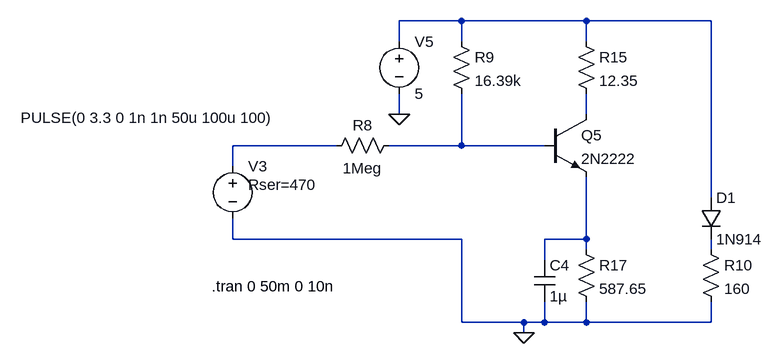
[diagram p0: schematic LED_Driver.asc]
LED_Driver.asc, the LTspice schematic file:
Version 4
SHEET 1 2416 1012
WIRE 1504 448 1408 448
WIRE 1696 448 1504 448
WIRE 1888 448 1696 448
WIRE 1408 480 1408 448
WIRE 1504 480 1504 448
WIRE 1696 480 1696 448
WIRE 1408 592 1408 560
WIRE 1696 592 1696 560
WIRE 1312 640 1152 640
WIRE 1504 640 1504 560
WIRE 1504 640 1392 640
WIRE 1632 640 1504 640
WIRE 1152 672 1152 640
WIRE 1888 720 1888 448
WIRE 1152 784 1152 752
WIRE 1504 784 1152 784
WIRE 1696 784 1696 688
WIRE 1696 784 1632 784
WIRE 1696 800 1696 784
WIRE 1888 800 1888 784
WIRE 1632 816 1632 784
WIRE 1504 912 1504 784
WIRE 1600 912 1504 912
WIRE 1632 912 1632 880
WIRE 1632 912 1600 912
WIRE 1696 912 1696 880
WIRE 1696 912 1632 912
WIRE 1888 912 1888 880
WIRE 1888 912 1696 912
WIRE 1600 928 1600 912
FLAG 1408 592 0
FLAG 1600 928 0
SYMBOL voltage 1152 656 R0
WINDOW 123 0 0 Left 2
WINDOW 39 24 44 Left 2
WINDOW 3 -326 -59 Left 2
SYMATTR SpiceLine Rser=470
SYMATTR Value PULSE(0 3.3 0 1n 1n 50u 100u 100)
SYMATTR InstName V3
SYMBOL res 1408 624 R90
WINDOW 0 0 56 VBottom 2
WINDOW 3 35 56 VTop 2
SYMATTR InstName R8
SYMATTR Value 1Meg
SYMBOL npn 1632 592 R0
SYMATTR InstName Q5
SYMATTR Value 2N2222
SYMBOL res 1488 464 R0
SYMATTR InstName R9
SYMATTR Value 16.39k
SYMBOL res 1680 464 R0
SYMATTR InstName R15
SYMATTR Value 12.35
SYMBOL voltage 1408 464 R0
WINDOW 123 0 0 Left 2
WINDOW 39 24 44 Left 2
SYMATTR InstName V5
SYMATTR Value 5
SYMBOL res 1680 784 R0
SYMATTR InstName R17
SYMATTR Value 587.65
SYMBOL cap 1616 816 R0
SYMATTR InstName C4
SYMATTR Value 1µ
SYMBOL diode 1872 720 R0
SYMATTR InstName D1
SYMATTR Value 1N914
SYMATTR Description Light Emitting Diode
SYMATTR Type led
SYMBOL res 1872 784 R0
SYMATTR InstName R10
SYMATTR Value 160
TEXT 1120 856 Left 2 !.tran 0 50m 0 10n

The netlist it stands for:
* LED_Driver.asc
V3 N003 0 PULSE(0 3.3 0 1n 1n 50u 100u 100) Rser=470
R8 N004 N003 1Meg
Q5 N002 N004 N005 0 2N2222
R9 N001 N004 16.39k
R15 N001 N002 12.35
V5 N001 0 5
R17 N005 0 587.65
C4 N005 0 1µ
D1 N001 N006 1N914
R10 N006 0 160
.model D D
.lib standard.dio
.model NPN NPN
.model PNP PNP
.lib standard.bjt
.tran 0 50m 0 10n
.backanno
.end